# EAGLE design USB-B board (EAGLE 7.6.0)
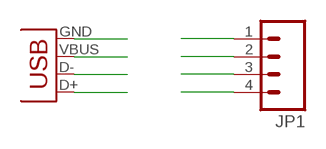
[diagram p0: schematic, sheet 1]

## Parts
JP1  M04JST-PTH  [JST-4-PTH]
USB-B-PTH  USB-B  USBPTH  [USB-B-PTH]

## Nets
D+: JP1.2 USB-B-PTH.D+
D-: JP1.3 USB-B-PTH.D-
GND: JP1.1 USB-B-PTH.GND
VCC: JP1.4 USB-B-PTH.VBUS

## Library data of the parts
JP1 = SparkFun-Connectors:M04: Header 4 Standard 4-pin 0.1" header. Use with straight break away headers (SKU : PRT-00116), right angle break away headers (PRT-00553), swiss pins (PRT-00743), machine pins (PRT-00117), and female headers (PRT-00115). Molex polarized connector foot print use with SKU : PRT-08231 with associated crimp pins and housings. 1MM SMD Version SKU: PRT-10208; SKU: PRT-09916
USB-B-PTH = SparkFun-Connectors:USB: USB Connectors USB-B-PTH is fully proven SKU : PRT-00139/CONN-08278 USB-miniB is fully proven SKU : PRT-00587 USB-A-PCB is untested. USB-A-H is throughly reviewed, but untested. Spark Fun Electronics SKU : PRT-00437 USB-B-SMT is throughly reviewed, but untested. Needs silkscreen touching up. USB-A-S has not been used/tested USB-MB-H has not been used/tested USB-MICROB has been used. CONN-09505; PROD_ID: CONN-08278

## Board
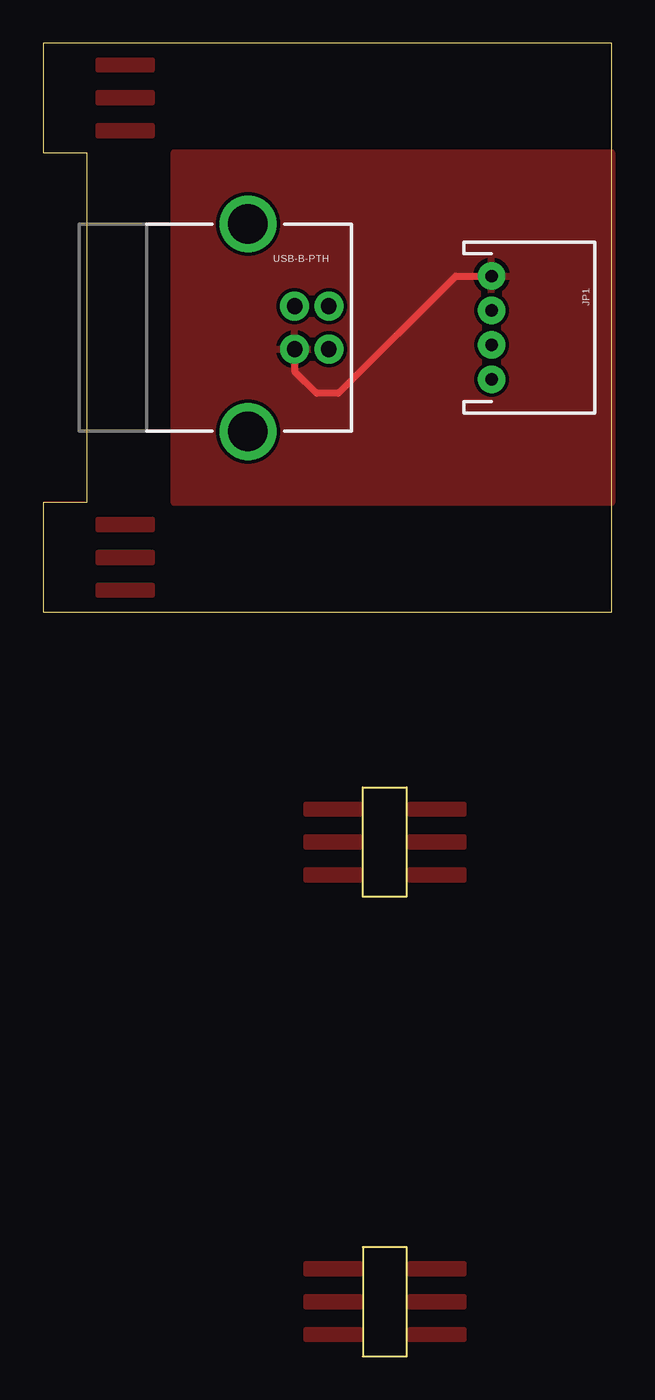
[diagram p1: board, top side]
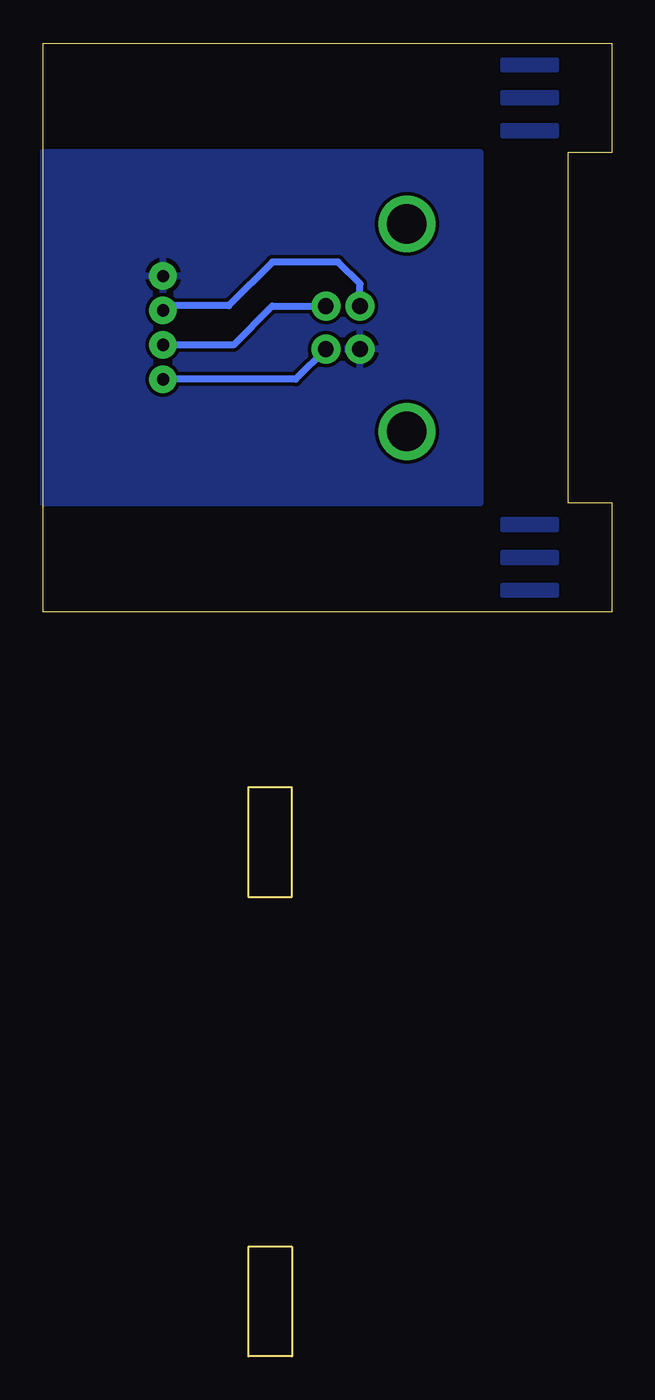
[diagram p2: board, bottom side, seen from below]

Size 33 x 76.2 mm. Coordinates in mm from the lower left corner, seen from the top.
Outline: 0,76.2 0,69.85 2.54,69.85 2.54,49.53 0,49.53 0,43.18 33,43.18 33,76.2 0,76.2
Outline: 18.56,33.02 21.1,33.02 21.1,26.67 18.56,26.67 18.56,33.02
Outline: 18.56,6.35 21.1,6.35 21.1,0 18.56,0 18.56,6.35
Copper layers (1*16): Top 0.035mm / dielectric 1.5mm / Bottom 0.035mm
Design rules "default *": minimum track width 10mil, minimum drill 24mil, track to track 8mil, track to pad 8mil, pad to pad 8mil, via to via 8mil, smd to smd 8mil, copper to edge 0mil, drill to drill 0mil, minimum pad ring 10mil, minimum via ring 8mil, stop-mask expansion 4mil, vias tented up to drill 0mil, thermal gap 10mil

### Footprints (pad centres in the part's own frame; a part is rotated, then mirrored left to right if it is on the bottom)
JST-4-PTH = drill 0.7 pad 1.6: 1 -3,0; 2 -1,0; 3 1,0; 4 3,0
USB-B-PTH = drill 0.914 pad 1.676: D+ 0,1.25; D- 1.981,1.25; GND 0,-1.25; VBUS 1.981,-1.25 | drill 2.286: S1 -2.718,-6.02; S2 -2.718,6.02

### Placement (x,y rotation side)
JP1  26.03,59.69 270 top
USB-B-PTH  14.6,59.69 0 top

### Tracks (layer width: path | path; a pad name or v marks a point on that pad's centre or on a via)
D+
  Bottom 0.406: JP1.2 25.77,60.96 22.23,60.96 19.69,63.5 15.88,63.5 14.6,62.23 USB-B-PTH.D+
D-
  Bottom 0.406: 16.61,60.96 USB-B-PTH.D- 19.7,60.94 21.95,58.69 JP1.3
GND
  Top 0.406: USB-B-PTH.GND 14.6,57.15 15.88,55.88 17.15,55.88 23.95,62.69 JP1.1
  pour Top: 7.62,69.85 33,69.85 33,49.53 7.62,49.53
  pour Bottom: 7.62,69.85 33,69.85 33,49.53 7.62,49.53
  pour Top: 7.62,69.85 33,69.85 7.62,49.53
N$1
  pour Bottom: 3.17,75.25 6.35,75.25 6.35,74.61 3.17,74.61
N$2
  pour Bottom: 3.17,73.34 6.35,73.34 6.35,72.71 3.17,72.71
N$3
  pour Bottom: 3.17,71.44 6.35,71.44 6.35,70.8 3.17,70.8
N$4
  pour Bottom: 3.17,48.58 6.35,48.58 6.35,47.94 3.17,47.94
N$5
  pour Bottom: 3.17,46.67 6.35,46.67 6.35,46.04 3.17,46.04
N$6
  pour Bottom: 3.17,44.77 6.35,44.77 6.35,44.13 3.17,44.13
N$7
  pour Top: 3.17,75.25 6.35,75.25 6.35,74.61 3.17,74.61
N$8
  pour Top: 3.17,73.34 6.35,73.34 6.35,72.71 3.17,72.71
N$9
  pour Top: 3.17,71.44 6.35,71.44 6.35,70.8 3.17,70.8
N$10
  pour Top: 3.17,48.58 6.35,48.58 6.35,47.94 3.17,47.94
N$11
  pour Top: 3.17,46.67 6.35,46.67 6.35,46.04 3.17,46.04
N$12
  pour Top: 3.17,44.77 6.35,44.77 6.35,44.13 3.17,44.13
N$16
  pour Top: 21.27,32.07 24.45,32.07 24.45,31.43 21.27,31.43
N$17
  pour Top: 21.27,30.16 24.45,30.16 24.45,29.53 21.27,29.53
N$18
  pour Top: 21.27,28.26 24.45,28.26 24.45,27.62 21.27,27.62
N$22
  pour Top: 21.27,5.4 24.45,5.4 24.45,4.76 21.27,4.76
N$23
  pour Top: 21.27,3.49 24.45,3.49 24.45,2.86 21.27,2.86
N$24
  pour Top: 21.27,1.59 24.45,1.59 24.45,0.95 21.27,0.95
N$28
  pour Top: 15.24,5.4 18.41,5.4 18.41,4.76 15.24,4.76
N$29
  pour Top: 15.24,3.49 18.41,3.49 18.41,2.86 15.24,2.86
N$30
  pour Top: 15.24,1.59 18.41,1.59 18.41,0.95 15.24,0.95
N$34
  pour Top: 15.24,32.07 18.41,32.07 18.41,31.43 15.24,31.43
N$35
  pour Top: 15.24,30.16 18.41,30.16 18.41,29.53 15.24,29.53
N$36
  pour Top: 15.24,28.26 18.41,28.26 18.41,27.62 15.24,27.62
VCC
  Bottom 0.406: USB-B-PTH.VBUS 18.34,56.69 JP1.4